# EAGLE schematic CRD (EAGLE 9.5.2)
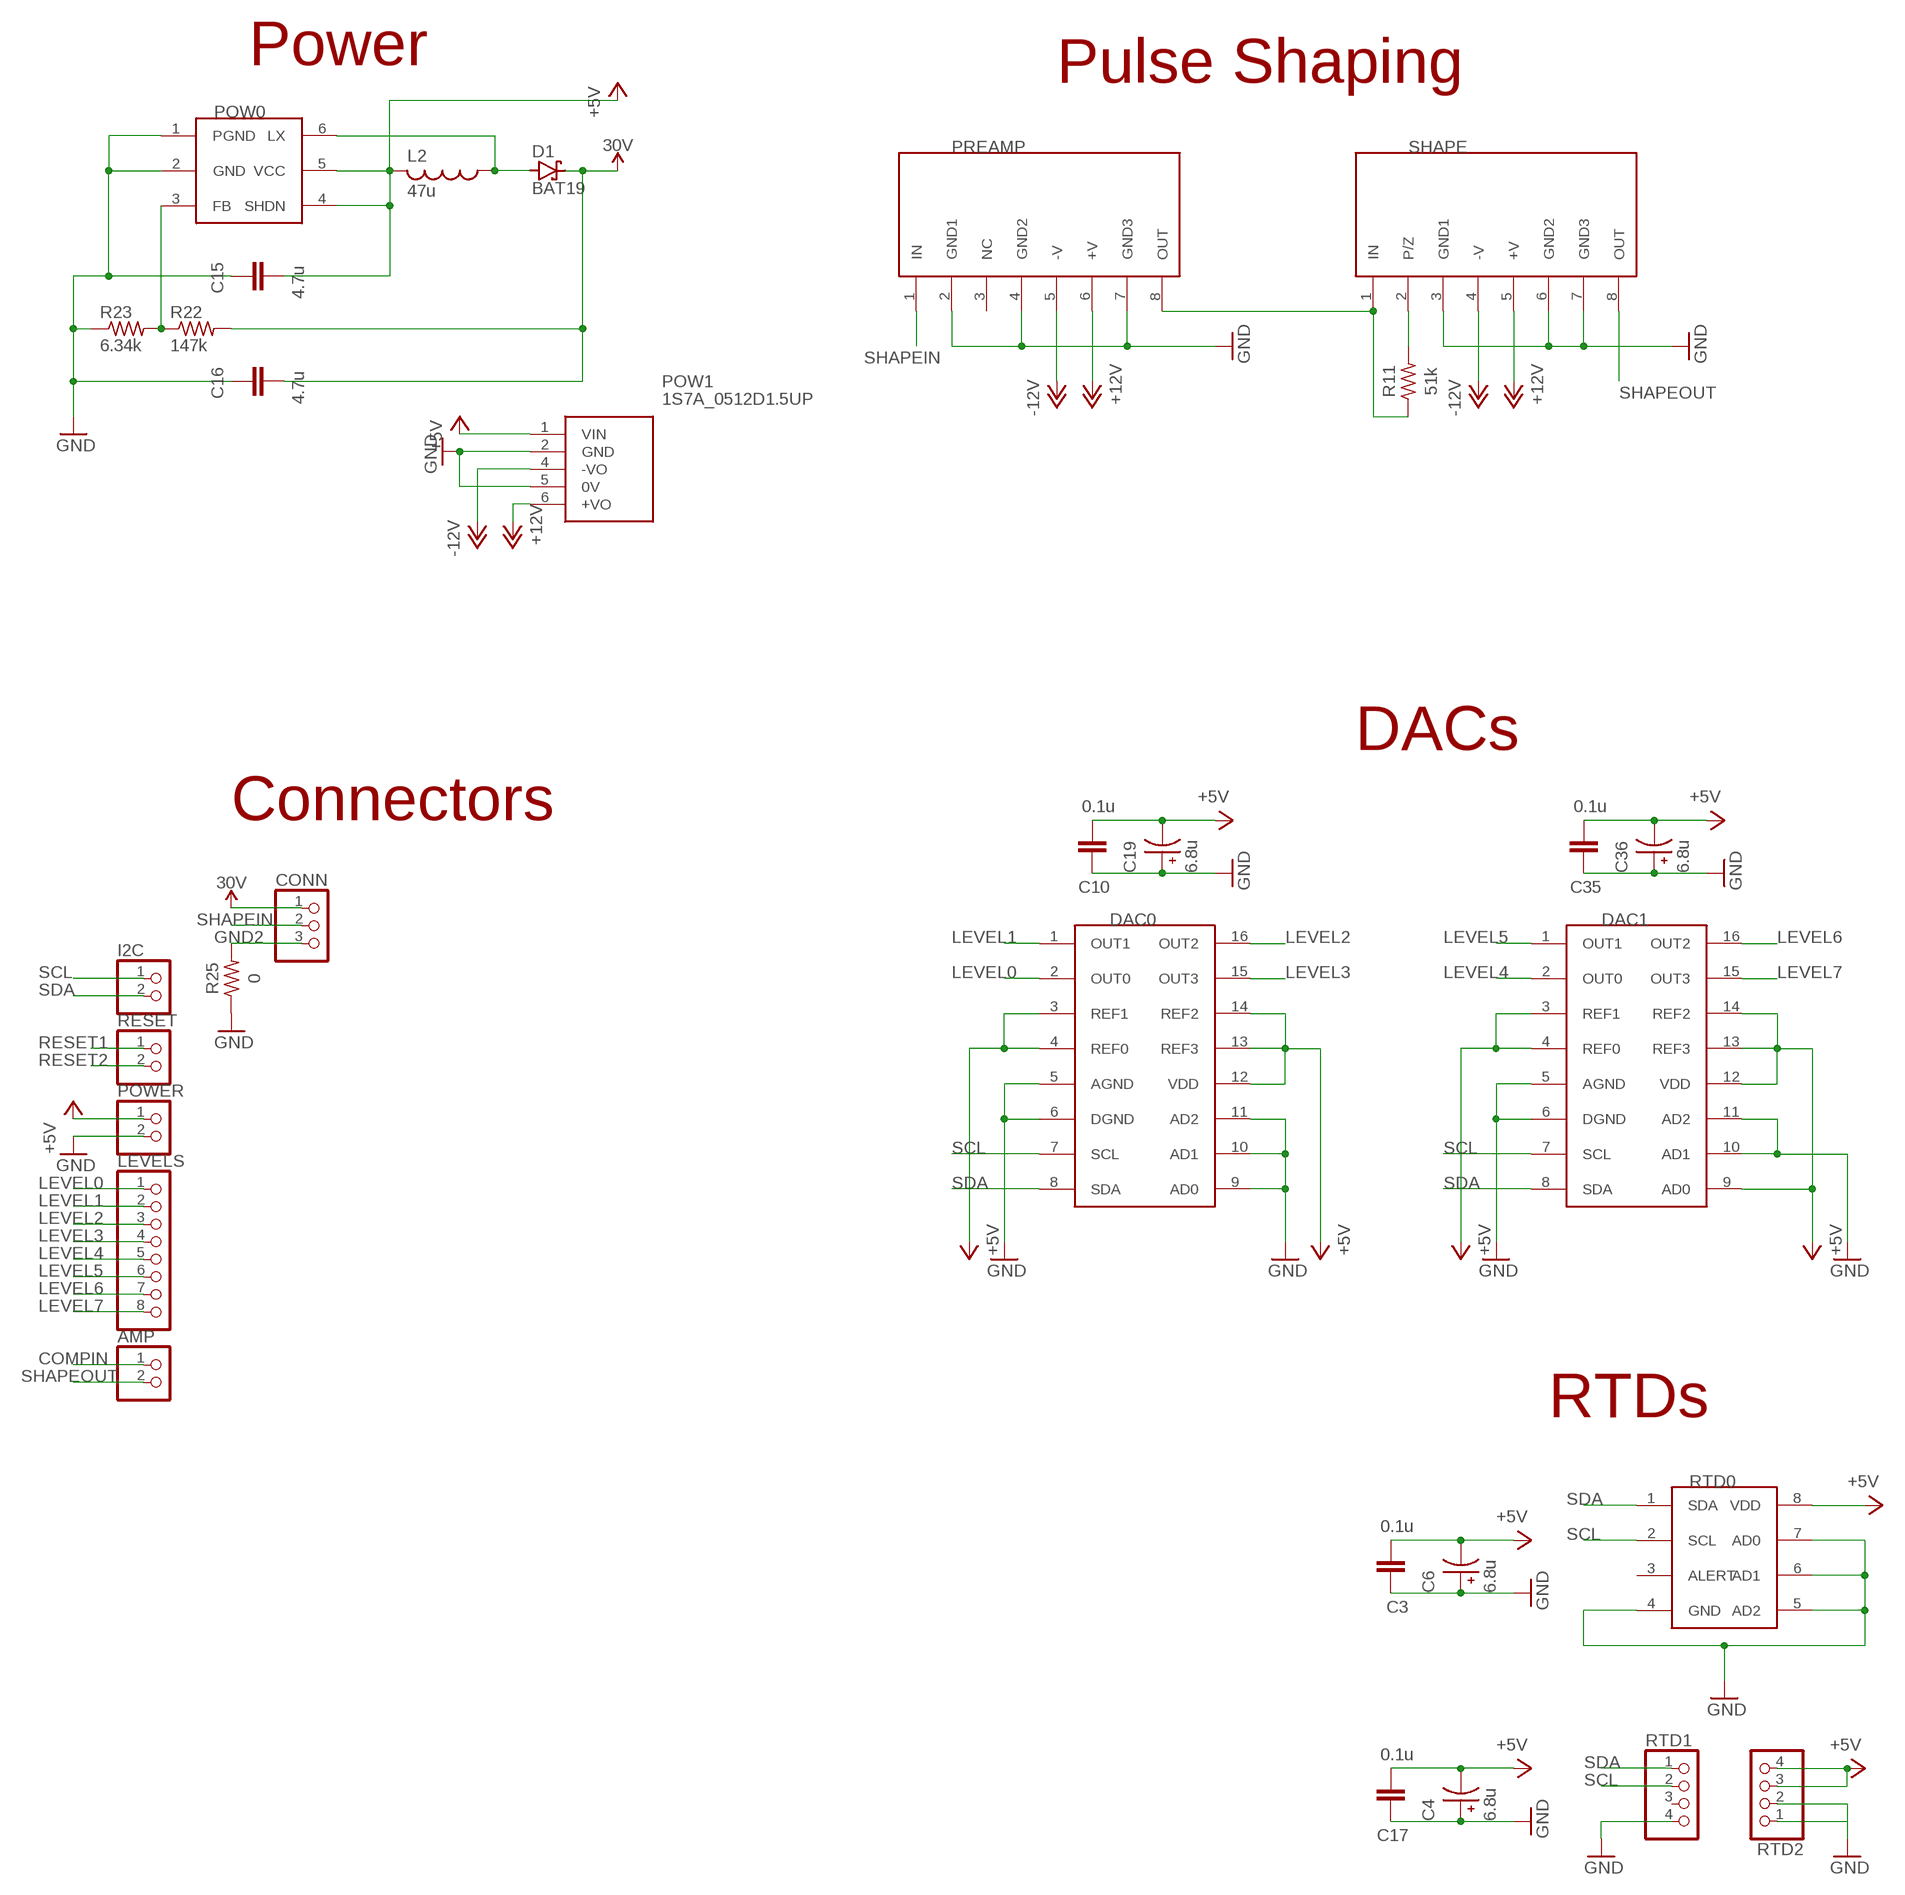
[diagram p0: schematic, sheet 1, part 1 of 2]
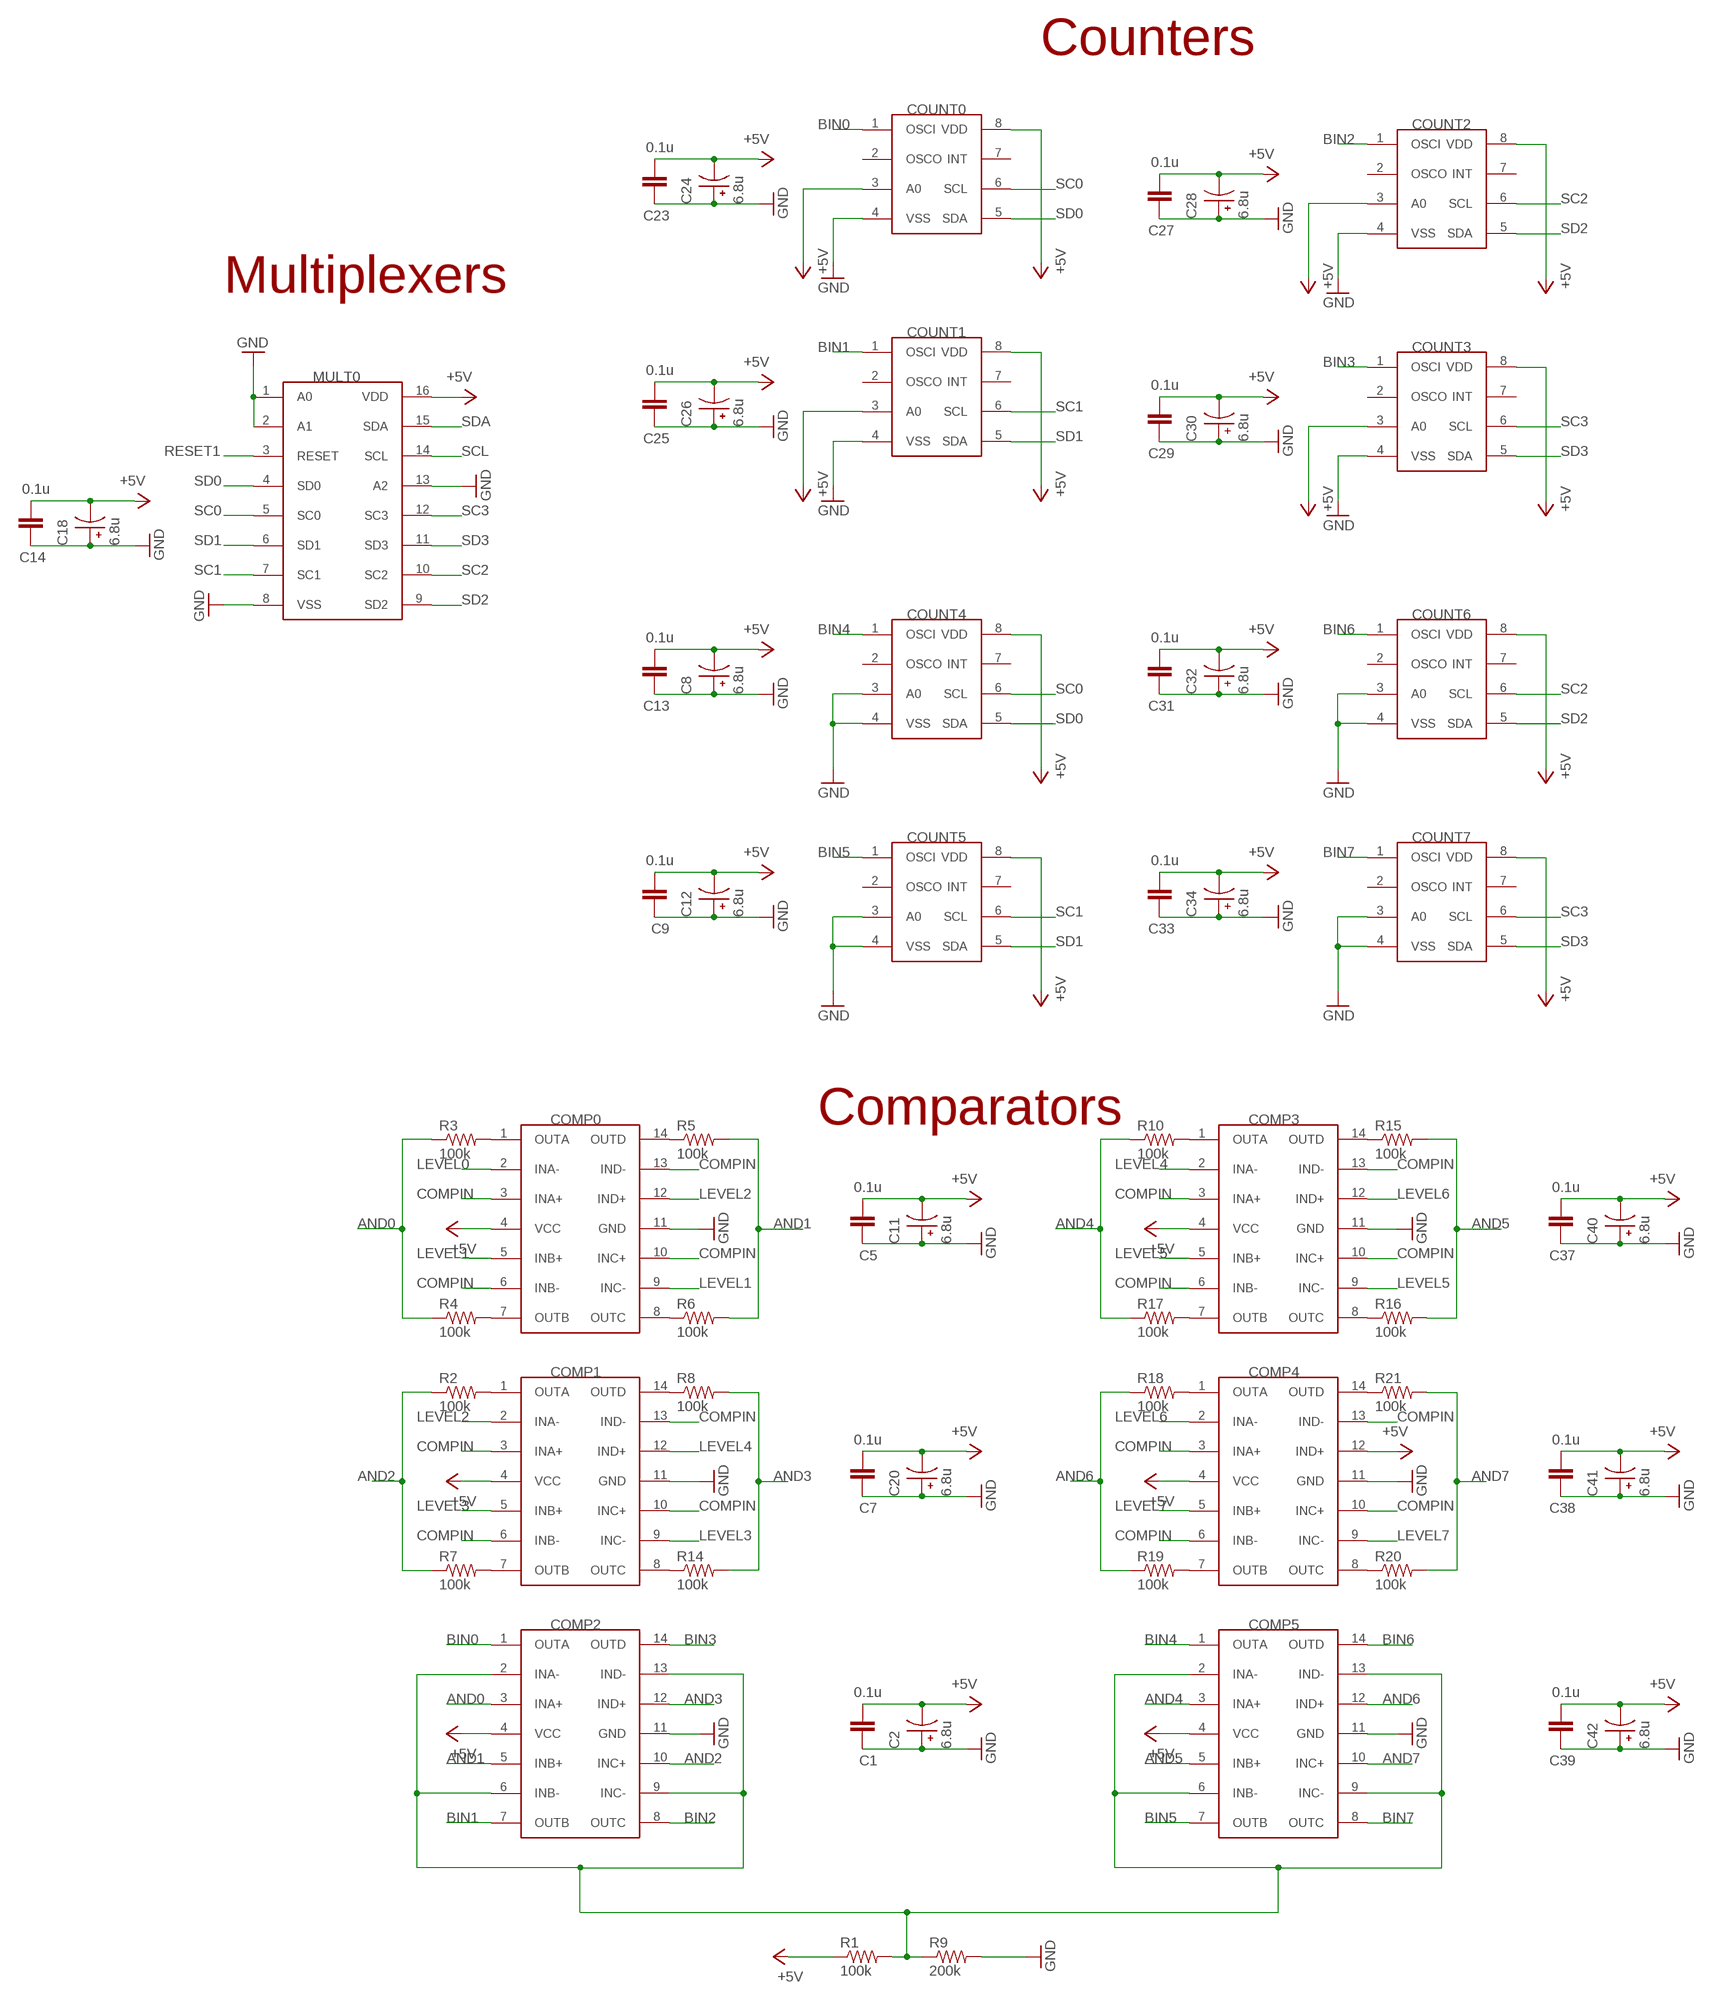
[diagram p1: schematic, sheet 1, part 2 of 2]

## Parts
AMP  PINHD-1X2  [1X02]
C1  0.1u  GRM31CR60J107ME39L  [CAP_1206]
C2  6.8u  EEAGA1V6R8  [CAPPRD150W45D400H700]
C3  0.1u  GRM31CR60J107ME39L  [CAP_1206]
C4  6.8u  EEAGA1V6R8  [CAPPRD150W45D400H700]
C5  0.1u  GRM31CR60J107ME39L  [CAP_1206]
C6  6.8u  EEAGA1V6R8  [CAPPRD150W45D400H700]
C7  0.1u  GRM31CR60J107ME39L  [CAP_1206]
C8  6.8u  EEAGA1V6R8  [CAPPRD150W45D400H700]
C9  0.1u  GRM31CR60J107ME39L  [CAP_1206]
C10  0.1u  GRM31CR60J107ME39L  [CAP_1206]
C11  6.8u  EEAGA1V6R8  [CAPPRD150W45D400H700]
C12  6.8u  EEAGA1V6R8  [CAPPRD150W45D400H700]
C13  0.1u  GRM31CR60J107ME39L  [CAP_1206]
C14  0.1u  GRM31CR60J107ME39L  [CAP_1206]
C15  4.7u  GRM31CR60J107ME39L  [CAP_1206]
C16  4.7u  GRM31CR60J107ME39L  [CAP_1206]
C17  0.1u  GRM31CR60J107ME39L  [CAP_1206]
C18  6.8u  EEAGA1V6R8  [CAPPRD150W45D400H700]
C19  6.8u  EEAGA1V6R8  [CAPPRD150W45D400H700]
C20  6.8u  EEAGA1V6R8  [CAPPRD150W45D400H700]
C23  0.1u  GRM31CR60J107ME39L  [CAP_1206]
C24  6.8u  EEAGA1V6R8  [CAPPRD150W45D400H700]
C25  0.1u  GRM31CR60J107ME39L  [CAP_1206]
C26  6.8u  EEAGA1V6R8  [CAPPRD150W45D400H700]
C27  0.1u  GRM31CR60J107ME39L  [CAP_1206]
C28  6.8u  EEAGA1V6R8  [CAPPRD150W45D400H700]
C29  0.1u  GRM31CR60J107ME39L  [CAP_1206]
C30  6.8u  EEAGA1V6R8  [CAPPRD150W45D400H700]
C31  0.1u  GRM31CR60J107ME39L  [CAP_1206]
C32  6.8u  EEAGA1V6R8  [CAPPRD150W45D400H700]
C33  0.1u  GRM31CR60J107ME39L  [CAP_1206]
C34  6.8u  EEAGA1V6R8  [CAPPRD150W45D400H700]
C35  0.1u  GRM31CR60J107ME39L  [CAP_1206]
C36  6.8u  EEAGA1V6R8  [CAPPRD150W45D400H700]
C37  0.1u  GRM31CR60J107ME39L  [CAP_1206]
C38  0.1u  GRM31CR60J107ME39L  [CAP_1206]
C39  0.1u  GRM31CR60J107ME39L  [CAP_1206]
C40  6.8u  EEAGA1V6R8  [CAPPRD150W45D400H700]
C41  6.8u  EEAGA1V6R8  [CAPPRD150W45D400H700]
C42  6.8u  EEAGA1V6R8  [CAPPRD150W45D400H700]
COMP0  MAX9108ESD+  [SOIC127P600X155-14N]
COMP1  MAX9108ESD+  [SOIC127P600X155-14N]
COMP2  MAX9108ESD+  [SOIC127P600X155-14N]
COMP3  MAX9108ESD+  [SOIC127P600X155-14N]
COMP4  MAX9108ESD+  [SOIC127P600X155-14N]
COMP5  MAX9108ESD+  [SOIC127P600X155-14N]
CONN  PINHD-1X3  [1X03]
COUNT0  PCF8583  [SOIC127P1032X265-8N]
COUNT1  PCF8583  [SOIC127P1032X265-8N]
COUNT2  PCF8583  [SOIC127P1032X265-8N]
COUNT3  PCF8583  [SOIC127P1032X265-8N]
COUNT4  PCF8583  [SOIC127P1032X265-8N]
COUNT5  PCF8583  [SOIC127P1032X265-8N]
COUNT6  PCF8583  [SOIC127P1032X265-8N]
COUNT7  PCF8583  [SOIC127P1032X265-8N]
D1  BAT19  [DO35-10]
DAC0  MAX520BEWE+  [SOIC127P1032X265-16N]
DAC1  MAX520BEWE+  [SOIC127P1032X265-16N]
I2C  PINHD-1X2  [1X02]
L2  47u  L-USL1812  [L1812]
LEVELS  PINHD-1X8  [1X08]
MULT0  PCA9546A  [SOIC127P600X175-16N]
POW0  MAX5025  [SOT95P240X110-6N]
POW1  1S7A_0512D1.5UP  [1S7A_0505D15UP]
POWER  PINHD-1X2  [1X02]
PREAMP  CR-113  [HDRV8W64P254_1X8_1016X508X838B]
R1  100k  ERJ-8GEY0R00V  [RES_1206]
R2  100k  ERJ-8GEY0R00V  [RES_1206]
R3  100k  ERJ-8GEY0R00V  [RES_1206]
R4  100k  ERJ-8GEY0R00V  [RES_1206]
R5  100k  ERJ-8GEY0R00V  [RES_1206]
R6  100k  ERJ-8GEY0R00V  [RES_1206]
R7  100k  ERJ-8GEY0R00V  [RES_1206]
R8  100k  ERJ-8GEY0R00V  [RES_1206]
R9  200k  ERJ-8GEY0R00V  [RES_1206]
R10  100k  ERJ-8GEY0R00V  [RES_1206]
R11  51k  R-US_AXIAL-11.7MM-PITCH  [RESAD1176W63L850D250B]
R14  100k  ERJ-8GEY0R00V  [RES_1206]
R15  100k  ERJ-8GEY0R00V  [RES_1206]
R16  100k  ERJ-8GEY0R00V  [RES_1206]
R17  100k  ERJ-8GEY0R00V  [RES_1206]
R18  100k  ERJ-8GEY0R00V  [RES_1206]
R19  100k  ERJ-8GEY0R00V  [RES_1206]
R20  100k  ERJ-8GEY0R00V  [RES_1206]
R21  100k  ERJ-8GEY0R00V  [RES_1206]
R22  147k  ERJ-8GEY0R00V  [RES_1206]
R23  6.34k  ERJ-8GEY0R00V  [RES_1206]
R25  0  R-US_AXIAL-7.2MM-PITCH  [RESAD724W46L381D178B]
RESET  PINHD-1X2  [1X02]
RTD0  NCT175DMR2G  [SOP65P490X110-8N]
RTD1  PINHD-1X4  [1X04]
RTD2  PINHD-1X4  [1X04]
SHAPE  CR-200  [HDRV8W64P254_1X8_1016X508X838B]

## Nets
+5V: C1.2 C2.N C3.2 C4.N C5.2 C6.N C7.2 C8.N C9.2 C10.2 C11.N C12.N C13.2 C14.2 C15.2 C17.2 C18.N C19.N C20.N C23.2 C24.N C25.2 C26.N C27.2 C28.N C29.2 C30.N C31.2 C32.N C33.2 C34.N C35.2 C36.N C37.2 C38.2 C39.2 C40.N C41.N C42.N COMP0.4(VCC) COMP1.4(VCC) COMP2.4(VCC) COMP3.4(VCC) COMP4.4(VCC) COMP4.12(IND+) COMP5.4(VCC) COUNT0.3(A0) COUNT0.8(VDD) COUNT1.3(A0) COUNT1.8(VDD) COUNT2.3(A0) COUNT2.8(VDD) COUNT3.3(A0) COUNT3.8(VDD) COUNT4.8(VDD) COUNT5.8(VDD) COUNT6.8(VDD) COUNT7.8(VDD) DAC0.3(REF1) DAC0.4(REF0) DAC0.12(VDD) DAC0.13(REF3) DAC0.14(REF2) DAC1.3(REF1) DAC1.4(REF0) DAC1.9(AD0) DAC1.12(VDD) DAC1.13(REF3) DAC1.14(REF2) L2.2 MULT0.16(VDD) POW0.4(SHDN) POW0.5(VCC) POW1.1(VIN) POWER.1 R1.1 RTD0.8(VDD) RTD2.3 RTD2.4
+12V: POW1.6(+VO) PREAMP.6(+V) SHAPE.5(+V)
-12V: POW1.4(-VO) PREAMP.5(-V) SHAPE.4(-V)
AND0: COMP2.3(INA+) R3.1 R4.1
AND1: COMP2.5(INB+) R5.2 R6.2
AND2: COMP2.10(INC+) R2.1 R7.1
AND3: COMP2.12(IND+) R8.2 R14.2
AND4: COMP5.3(INA+) R10.1 R17.1
AND5: COMP5.5(INB+) R15.2 R16.2
AND6: COMP5.12(IND+) R18.1 R19.1
AND7: COMP5.10(INC+) R20.2 R21.2
BIN0: COMP2.1(OUTA) COUNT0.1(OSCI)
BIN1: COMP2.7(OUTB) COUNT1.1(OSCI)
BIN2: COMP2.8(OUTC) COUNT2.1(OSCI)
BIN3: COMP2.14(OUTD) COUNT3.1(OSCI)
BIN4: COMP5.1(OUTA) COUNT4.1(OSCI)
BIN5: COMP5.7(OUTB) COUNT5.1(OSCI)
BIN6: COMP5.14(OUTD) COUNT6.1(OSCI)
BIN7: COMP5.8(OUTC) COUNT7.1(OSCI)
COMPIN: AMP.1 COMP0.3(INA+) COMP0.6(INB-) COMP0.10(INC+) COMP0.13(IND-) COMP1.3(INA+) COMP1.6(INB-) COMP1.10(INC+) COMP1.13(IND-) COMP3.3(INA+) COMP3.6(INB-) COMP3.10(INC+) COMP3.13(IND-) COMP4.3(INA+) COMP4.6(INB-) COMP4.10(INC+) COMP4.13(IND-)
GND: C1.1 C2.P C3.1 C4.P C5.1 C6.P C7.1 C8.P C9.1 C10.1 C11.P C12.P C13.1 C14.1 C15.1 C16.1 C17.1 C18.P C19.P C20.P C23.1 C24.P C25.1 C26.P C27.1 C28.P C29.1 C30.P C31.1 C32.P C33.1 C34.P C35.1 C36.P C37.1 C38.1 C39.1 C40.P C41.P C42.P COMP0.11(GND) COMP1.11(GND) COMP2.11(GND) COMP3.11(GND) COMP4.11(GND) COMP5.11(GND) COUNT0.4(VSS) COUNT1.4(VSS) COUNT2.4(VSS) COUNT3.4(VSS) COUNT4.3(A0) COUNT4.4(VSS) COUNT5.3(A0) COUNT5.4(VSS) COUNT6.3(A0) COUNT6.4(VSS) COUNT7.3(A0) COUNT7.4(VSS) DAC0.5(AGND) DAC0.6(DGND) DAC0.9(AD0) DAC0.10(AD1) DAC0.11(AD2) DAC1.5(AGND) DAC1.6(DGND) DAC1.10(AD1) DAC1.11(AD2) MULT0.1(A0) MULT0.2(A1) MULT0.8(VSS) MULT0.13(A2) POW0.1(PGND) POW0.2(GND) POW1.2(GND) POW1.5(0V) POWER.2 PREAMP.2(GND1) PREAMP.4(GND2) PREAMP.7(GND3) R9.2 R23.1 R25.1 RTD0.4(GND) RTD0.5(AD2) RTD0.6(AD1) RTD0.7(AD0) RTD1.4 RTD2.2 SHAPE.3(GND1) SHAPE.6(GND2) SHAPE.7(GND3)
GND2: CONN.3 R25.2
LEVEL0: COMP0.2(INA-) DAC0.2(OUT0) LEVELS.1
LEVEL1: COMP0.5(INB+) COMP0.9(INC-) DAC0.1(OUT1) LEVELS.2
LEVEL2: COMP0.12(IND+) COMP1.2(INA-) DAC0.16(OUT2) LEVELS.3
LEVEL3: COMP1.5(INB+) COMP1.9(INC-) DAC0.15(OUT3) LEVELS.4
LEVEL4: COMP1.12(IND+) COMP3.2(INA-) DAC1.2(OUT0) LEVELS.5
LEVEL5: COMP3.5(INB+) COMP3.9(INC-) DAC1.1(OUT1) LEVELS.6
LEVEL6: COMP3.12(IND+) COMP4.2(INA-) DAC1.16(OUT2) LEVELS.7
LEVEL7: COMP4.5(INB+) COMP4.9(INC-) DAC1.15(OUT3) LEVELS.8
N$1: COMP0.1(OUTA) R3.2
N$2: COMP0.7(OUTB) R4.2
N$3: COMP0.14(OUTD) R5.1
N$4: COMP0.8(OUTC) R6.1
N$5: COMP1.1(OUTA) R2.2
N$6: COMP1.7(OUTB) R7.2
N$7: COMP1.14(OUTD) R8.1
N$8: COMP1.8(OUTC) R14.1
N$9: PREAMP.8(OUT) R11.1 SHAPE.1(IN)
N$10: R11.2 SHAPE.2(P/Z)
N$11: D1.A L2.1 POW0.6(LX)
N$12: POW0.3(FB) R22.1 R23.2
N$13: COMP2.2(INA-) COMP2.6(INB-) COMP2.9(INC-) COMP2.13(IND-) COMP5.2(INA-) COMP5.6(INB-) COMP5.9(INC-) COMP5.13(IND-) R1.2 R9.1
N$14: COMP3.1(OUTA) R10.2
N$15: COMP3.14(OUTD) R15.1
N$16: COMP3.8(OUTC) R16.1
N$17: COMP3.7(OUTB) R17.2
N$18: COMP4.1(OUTA) R18.2
N$19: COMP4.7(OUTB) R19.2
N$20: COMP4.8(OUTC) R20.1
N$21: RTD2.1
N$22: COMP4.14(OUTD) R21.1
RESET1: MULT0.3(RESET) RESET.1
RESET2: RESET.2
SC0: COUNT0.6(SCL) COUNT4.6(SCL) MULT0.5(SC0)
SC1: COUNT1.6(SCL) COUNT5.6(SCL) MULT0.7(SC1)
SC2: COUNT2.6(SCL) COUNT6.6(SCL) MULT0.10(SC2)
SC3: COUNT3.6(SCL) COUNT7.6(SCL) MULT0.12(SC3)
SCL: DAC0.7(SCL) DAC1.7(SCL) I2C.1 MULT0.14(SCL) RTD0.2(SCL) RTD1.2
SD0: COUNT0.5(SDA) COUNT4.5(SDA) MULT0.4(SD0)
SD1: COUNT1.5(SDA) COUNT5.5(SDA) MULT0.6(SD1)
SD2: COUNT2.5(SDA) COUNT6.5(SDA) MULT0.9(SD2)
SD3: COUNT3.5(SDA) COUNT7.5(SDA) MULT0.11(SD3)
SDA: DAC0.8(SDA) DAC1.8(SDA) I2C.2 MULT0.15(SDA) RTD0.1(SDA) RTD1.1
SHAPEIN: CONN.2 PREAMP.1(IN)
SHAPEOUT: AMP.2 SHAPE.8(OUT)
VIN: C16.2 CONN.1 D1.C R22.2 ; supply symbol labelled 30V
Unconnected: COUNT0.2(OSCO) COUNT0.7(INT) COUNT1.2(OSCO) COUNT1.7(INT) COUNT2.2(OSCO) COUNT2.7(INT) COUNT3.2(OSCO) COUNT3.7(INT) COUNT4.2(OSCO) COUNT4.7(INT) COUNT5.2(OSCO) COUNT5.7(INT) COUNT6.2(OSCO) COUNT6.7(INT) COUNT7.2(OSCO) COUNT7.7(INT) PREAMP.3(NC) RTD0.3(ALERT) RTD1.3

## Notes on the sheet
- Counters
- Multiplexers
- Power | Pulse Shaping
- DACs
- Connectors
- Comparators
- RTDs

## Library data of the parts
AMP I2C POWER RESET = pinhead:PINHD-1X2: PIN HEADER
C1 C3 C5 C7 C9 C10 C13-C17 C23 C25 C27 C29 C31 C33 C35 C37-C39 = Resistor_Capacitor:GRM31CR60J107ME39L: CAP CER 100UF 6.3V X5R 1206 Manufacturer's datasheet <https://www.murata.com/~/media/webrenewal/support/library/catalog/products/capacitor/mlcc/c02e.ashx?la=en-us>; CREATED_BY: PCBLayout.com; DIGIKEY_PART_NUMBER: GRM31CR60J107ME39L; MANUFACTURER: Murata Electronics North America; MPN: GRM31CR60J107ME39L; PACKAGE: SMD 1206
C2 C4 C6 C8 C11 C12 C18-C20 C24 C26 C28 C30 C32 C34 C36 C40-C42 = EEAGA1V6R8:EEAGA1V6R8: GA-A; DESCRIPTION: CAP ALUM 6.8UF 20% 35V RADIAL; DIGI-KEY_PART_NUMBER: P14493-ND; MF: Panasonic; MP: EEAGA1V6R8; PACKAGE: RADIAL-2 Panasonic; PURCHASE-URL: https://pricing.snapeda.com/search/part/EEAGA1V6R8/?ref=eda
COMP0 COMP1-COMP5 = CRD:MAX9108ESD+
CONN = pinhead:PINHD-1X3: PIN HEADER
COUNT0 COUNT1-COUNT7 = CRD:PCF8583
D1 = diode:BAT19: DIODE barrier diode
DAC0 DAC1 = CRD:MAX520BEWE+
L2 = rcl:L-US: INDUCTOR, American symbol; SPICEPREFIX: L
LEVELS = pinhead:PINHD-1X8: PIN HEADER
MULT0 = CRD:PCA9546A
POW0 = CRD:MAX5025
POW1 = 1S7A_0512D1.5UP:1S7A_0512D1.5UP: 1W ? Dual Output DC-DC Converter - Fixed Input - Isolated & Unregulated Source: Datasheet <https://gaptec-electronic.com/datenblaetter/1S7A_1.5UP.pdf>; DESCRIPTION: 1W ? Dual Output DC-DC Converter - Fixed Input - Isolated & Unregulated; HEIGHT: 10.41mm; MANUFACTURER_NAME: Gaptec; MANUFACTURER_PART_NUMBER: 1S7A_0512D1.5UP
PREAMP = CRD:CR-113
R1-R10 R14-R23 = Resistor_Capacitor:ERJ-8GEY0R00V: RES SMD 0 OHM JUMPER 1/4W 1206 Manufacturer's datasheet <https://industrial.panasonic.com/ww/products/resistors/chip-resistors/general-purpose-chip-resistors/thick-film-chip-resistors/ERJ8GEY0R00V>; CREATED_BY: PCBLayout.com; DIGIKEY_PART_NUMBER: P0.0ETR-ND; MANUFACTURER: Panasonic Electronic Components; MPN: ERJ-8GEY0R00V; PACKAGE: SMD 1206
R11 R25 = Resistor:R-US: Resistor Fixed - ANSI; CATEGORY: Resistor; SUB-CATEGORY: Fixed
RTD0 = CRD:NCT175DMR2G
RTD1 RTD2 = pinhead:PINHD-1X4: PIN HEADER
SHAPE = CRD:CR-200